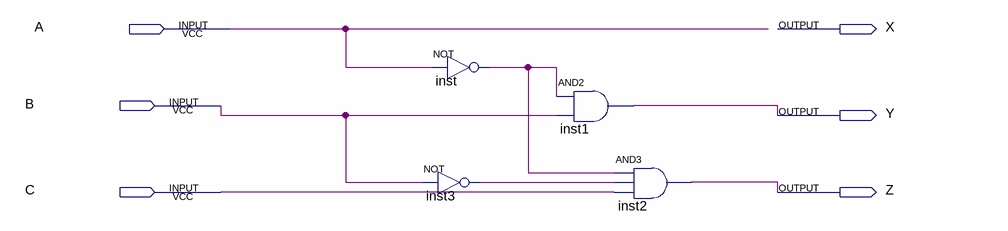
[diagram p0: schematic sheet]
// Quartus schematic PriorityCaller.bdf as structural Verilog: 4 symbols, 6 pins
module PriorityCaller (
  input  A,
  input  B,
  input  C,
  output X,
  output Y,
  output Z
);

  wire inst3_out, inst_out;

  not inst (inst_out, A);
  not inst3 (inst3_out, B);
  and inst1 (Y, inst_out, B);
  and inst2 (Z, inst_out, inst3_out, C);
endmodule
